# EAGLE design larrow (EAGLE 8.3.2)
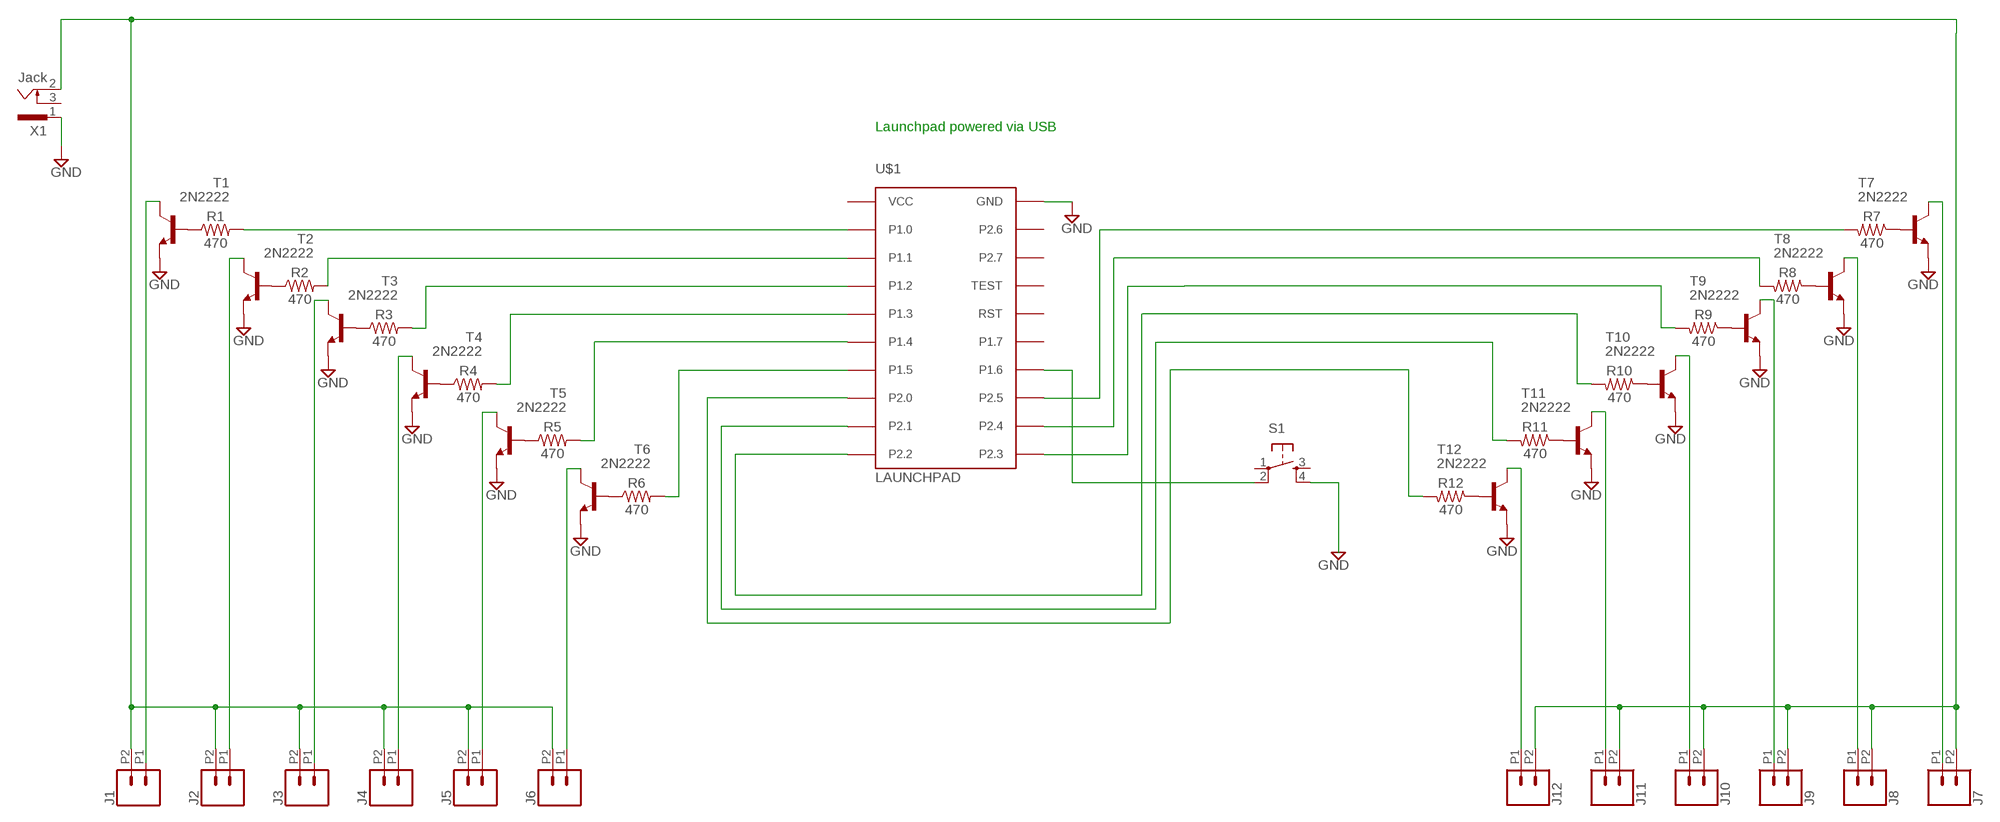
[diagram p0: schematic, sheet 1]

## Parts
J1  CONN_022.54MM_SCREWTERM  [1X02_2.54_SCREWTERM]
J2  CONN_022.54MM_SCREWTERM  [1X02_2.54_SCREWTERM]
J3  CONN_022.54MM_SCREWTERM  [1X02_2.54_SCREWTERM]
J4  CONN_022.54MM_SCREWTERM  [1X02_2.54_SCREWTERM]
J5  CONN_022.54MM_SCREWTERM  [1X02_2.54_SCREWTERM]
J6  CONN_022.54MM_SCREWTERM  [1X02_2.54_SCREWTERM]
J7  CONN_022.54MM_SCREWTERM  [1X02_2.54_SCREWTERM]
J8  CONN_022.54MM_SCREWTERM  [1X02_2.54_SCREWTERM]
J9  CONN_022.54MM_SCREWTERM  [1X02_2.54_SCREWTERM]
J10  CONN_022.54MM_SCREWTERM  [1X02_2.54_SCREWTERM]
J11  CONN_022.54MM_SCREWTERM  [1X02_2.54_SCREWTERM]
J12  CONN_022.54MM_SCREWTERM  [1X02_2.54_SCREWTERM]
R1  470  1KOHM-HORIZ-1/4W-1%  [AXIAL-0.3]
R2  470  1KOHM-HORIZ-1/4W-1%  [AXIAL-0.3]
R3  470  1KOHM-HORIZ-1/4W-1%  [AXIAL-0.3]
R4  470  1KOHM-HORIZ-1/4W-1%  [AXIAL-0.3]
R5  470  1KOHM-HORIZ-1/4W-1%  [AXIAL-0.3]
R6  470  1KOHM-HORIZ-1/4W-1%  [AXIAL-0.3]
R7  470  1KOHM-HORIZ-1/4W-1%  [AXIAL-0.3]
R8  470  1KOHM-HORIZ-1/4W-1%  [AXIAL-0.3]
R9  470  1KOHM-HORIZ-1/4W-1%  [AXIAL-0.3]
R10  470  1KOHM-HORIZ-1/4W-1%  [AXIAL-0.3]
R11  470  1KOHM-HORIZ-1/4W-1%  [AXIAL-0.3]
R12  470  1KOHM-HORIZ-1/4W-1%  [AXIAL-0.3]
S1  TAC_SWITCHPTH  [TACTILE-PTH]
T1  2N2222  [TO92-EBC-OVAL]
T2  2N2222  [TO92-EBC-OVAL]
T3  2N2222  [TO92-EBC-OVAL]
T4  2N2222  [TO92-EBC-OVAL]
T5  2N2222  [TO92-EBC-OVAL]
T6  2N2222  [TO92-EBC-OVAL]
T7  2N2222  [TO92-EBC-OVAL]
T8  2N2222  [TO92-EBC-OVAL]
T9  2N2222  [TO92-EBC-OVAL]
T10  2N2222  [TO92-EBC-OVAL]
T11  2N2222  [TO92-EBC-OVAL]
T12  2N2222  [TO92-EBC-OVAL]
U$1  LAUNCHPAD  [LAUNCHPAD]
X1  Jack  SCD-014A  [SCD-014-A]

## Nets
GND: S1.4 T1.E T2.E T3.E T4.E T5.E T6.E T7.E T8.E T9.E T10.E T11.E T12.E U$1.GND X1.1
N$1: J2.P1 T2.C
N$2: J1.P1 T1.C
N$3: R2.P$1 T2.B
N$4: R1.P$1 T1.B
N$5: R1.P$2 U$1.P1.0
N$6: R3.P$1 T3.B
N$7: J3.P1 T3.C
N$8: R4.P$1 T4.B
N$9: J4.P1 T4.C
N$10: R2.P$2 U$1.P1.1
N$11: R3.P$2 U$1.P1.2
N$12: R4.P$2 U$1.P1.3
N$13: R5.P$1 T5.B
N$14: J5.P1 T5.C
N$15: R5.P$2 U$1.P1.4
N$16: R6.P$1 T6.B
N$17: J6.P1 T6.C
N$18: R6.P$2 U$1.P1.5
N$20: R7.P$1 T7.B
N$21: J1.P2 J2.P2 J3.P2 J4.P2 J5.P2 J6.P2 J7.P2 J8.P2 J9.P2 J10.P2 J11.P2 J12.P2 X1.2
N$23: J7.P1 T7.C
N$24: R8.P$1 T8.B
N$25: J8.P1 T8.C
N$26: R9.P$1 T9.B
N$27: J9.P1 T9.C
N$28: R10.P$1 T10.B
N$29: J10.P1 T10.C
N$30: R8.P$2 U$1.P2.4
N$31: R9.P$2 U$1.P2.3
N$32: R10.P$2 U$1.P2.2
N$33: R11.P$1 T11.B
N$34: J11.P1 T11.C
N$35: R11.P$2 U$1.P2.1
N$36: R12.P$1 T12.B
N$37: J12.P1 T12.C
N$38: R12.P$2 U$1.P2.0
N$41: R7.P$2 U$1.P2.5
N$42: S1.2 U$1.P1.6
Unconnected: S1.1 S1.3 U$1.P1.7 U$1.P2.6 U$1.P2.7 U$1.RST U$1.TEST X1.3

## Notes on the sheet
- Launchpad powered via USB

## Power pins joined to a net without a drawn wire
VCC: U$1.VCC

## Library data of the parts
J1-J12 = SparkFun-Connectors:CONN_02: Multi connection point. Often used as Generic Header-pin footprint for 0.1 inch spaced/style header connections On any of the 0.1 inch spaced packages, you can populate with these: Break Away Headers - Straight <https://www.sparkfun.com/products/116> (PRT-00116) Break Away Male Headers - Right Angle <https://www.sparkfun.com/products/553> (PRT-00553) Female Headers <https://www.sparkfun.com/products/115> (PRT-00115) Break Away Headers - Machine Pin <https://www.sparkfun.com/products/117> (PRT-00117) Break Away Female Headers - Swiss Machine Pin <https://www.sparkfun.com/products/743> (PRT-00743) For SCREWTERMINALS and SPRING TERMINALS visit here: Screw Terimnals on SparkFun.com <https://www.sparkfun.com/search/results?term=Screw+Terminals> (5mm/3.5mm/2.54mm spacing) This device is also useful as a general connection point to wire up your design to another part of your project. Our various solder wires solder well into these plated through hole pads. Hook-Up Wire - Assortment (Stranded, 22 AWG) <https://www.sparkfun.com/products/11375> (PRT-11375) Hook-Up Wire - Assortment (Solid Core, 22 AWG) <https://www.sparkfun.com/products/11367> (PRT-11367) View the entire wire category on our website here <https://www.sparkfun.com/categories/141> Special notes: Molex polarized connector foot print use with: PRT-08233 with associated crimp pins and housings. 2.54_SCREWTERM for use with PRT-10571. 3.5mm Screw Terminal footprints for PRT-08084 5mm Screw Terminal footprints for use with PRT-08432
R1-R12 = SparkFun-Resistors:1KOHM: 1kΩ resistor A resistor is a passive two-terminal electrical component that implements electrical resistance as a circuit element. Resistors act to reduce current flow, and, at the same time, act to lower voltage levels within circuits. - Wikipedia; PROD_ID: RES-12182; VALUE: 1k
S1 = SparkFun-Retired:TAC_SWITCH: Momentary Switch Button commonly used for reset or general input. Spark Fun Electronics SKU : COM-00097 SMT- SWCH-08247
T1-T12 = adafruit:2N2222: NPN TRANSISTOR Big oval pads
U$1 = TI_launchpad:LAUNCHPAD: MSP-EXP430G2 LaunchPad Booster Pack layouts. LAUNCHPAD: Full-size board LAUNCHPAD-50MM: 50x50mm board covering the button area LAUNCHPAD-50MM-LEFT: 50x50mm board leaving the button area open. Tall LaunchPad components marked on Reference for reference.
X1 = con-shiua-chyuan:SCD-014A: Power Jack 2.5mm; OC_FARNELL: unknown; OC_NEWARK: unknown

## Board
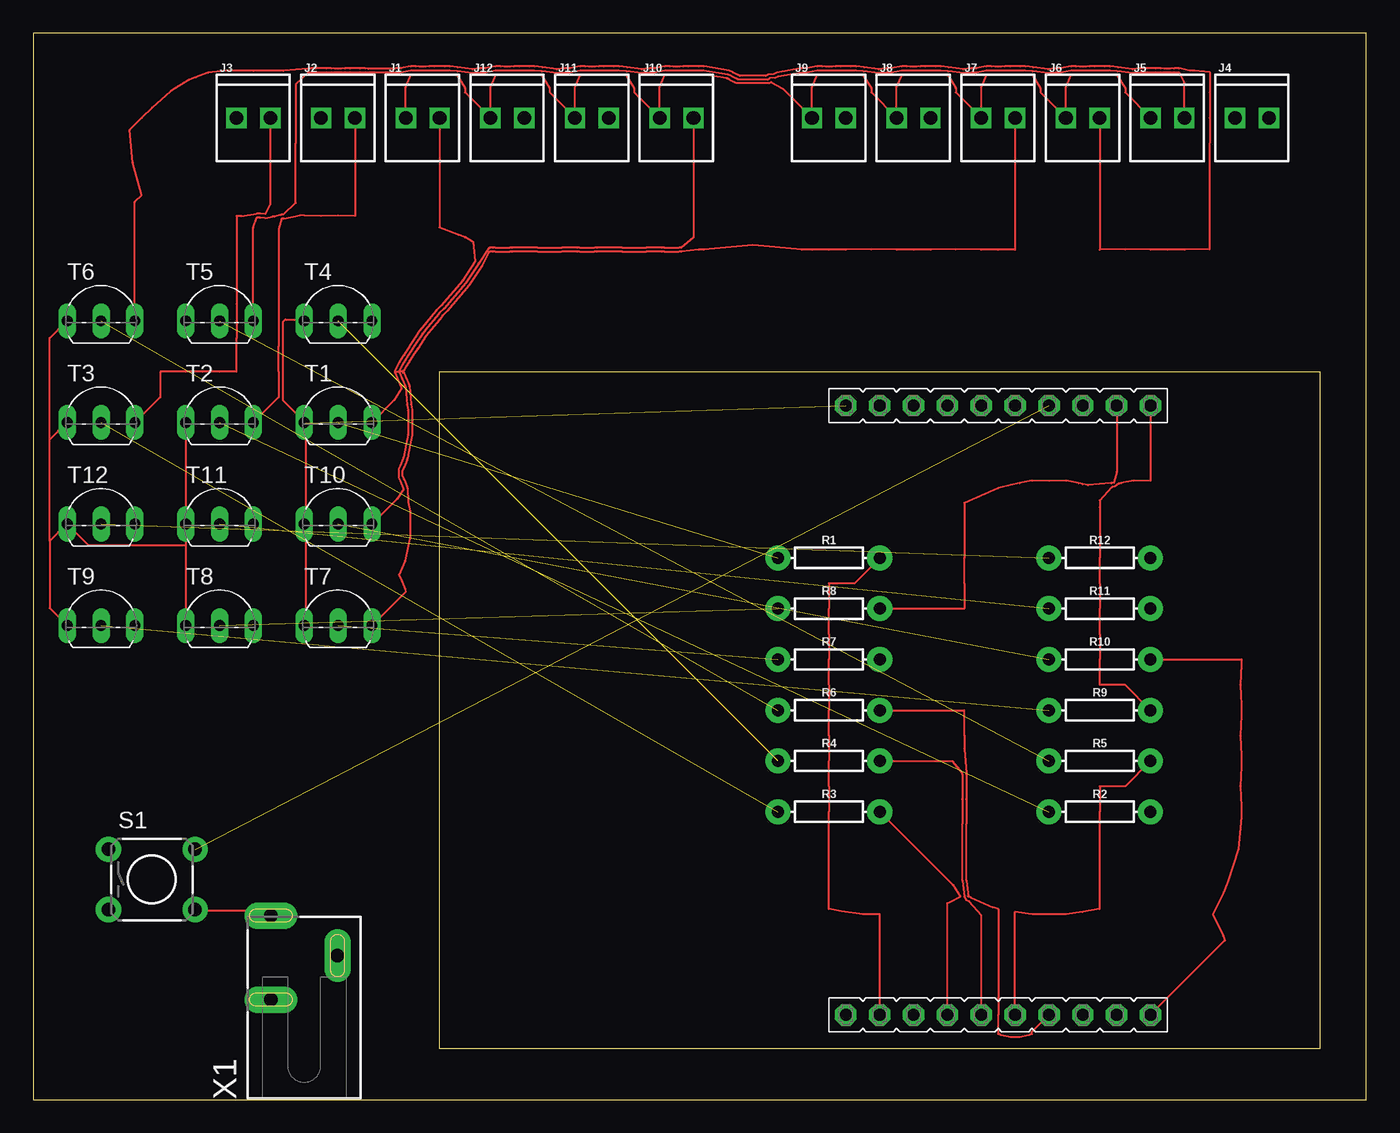
[diagram p1: board, top side]
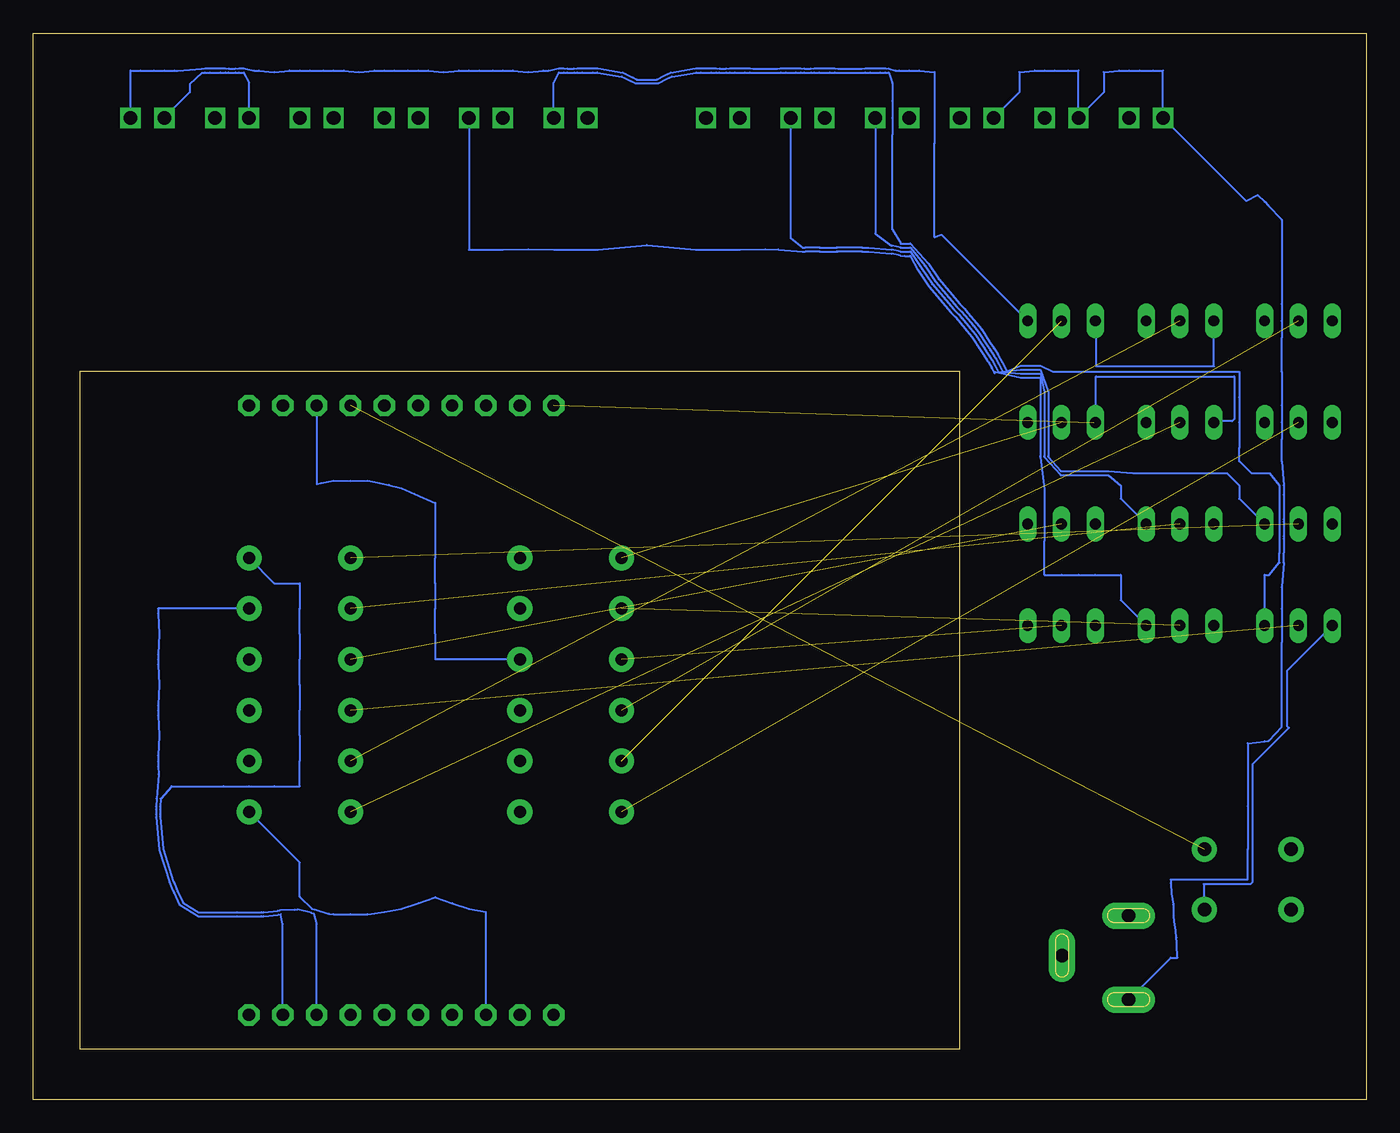
[diagram p2: board, bottom side, seen from below]

Size 100 x 80 mm. Coordinates in mm from the lower left corner, seen from the top.
Outline: 0,0 100,0 100,80 0,80 0,0
Copper layers (1*16): Top 0.035mm / dielectric 1.5mm / Bottom 0.035mm
Design rules "default": minimum track width 6mil, minimum drill 0.35mm, track to track 6mil, track to pad 6mil, pad to pad 6mil, via to via 6mil, smd to smd 6mil, copper to edge 40mil, drill to drill 6mil, minimum pad ring 10mil, minimum via ring 8mil, stop-mask expansion 4mil, vias tented up to drill 0mil, thermal gap 10mil

### Footprints (pad centres in the part's own frame; a part is rotated, then mirrored left to right if it is on the bottom)
1X02_2.54_SCREWTERM = drill 1.016 square: P1 2.54,0; P2 0,0
AXIAL-0.3 = drill 0.9 pad 1.88: P$1 -3.81,0; P$2 3.81,0
TACTILE-PTH = drill 1.016 pad 1.88: 1 -3.251,2.261; 2 3.251,2.261; 3 -3.251,-2.261; 4 3.251,-2.261
TO92-EBC-OVAL = drill 0.813 long: B 0,-1.27; C 2.54,-1.27; E -2.54,-1.27
LAUNCHPAD = drill 0.914 pad 1.6 octagon: GND 30.48,48.26; P1.0 33.02,2.54; P1.1 35.56,2.54; P1.2 38.1,2.54; P1.3 40.64,2.54; P1.4 43.18,2.54; P1.5 45.72,2.54; P1.6 45.72,48.26; P1.7 43.18,48.26; P2.0 48.26,2.54; P2.1 50.8,2.54; P2.2 53.34,2.54; P2.3 53.34,48.26; P2.4 50.8,48.26; P2.5 48.26,48.26; P2.6 33.02,48.26; P2.7 35.56,48.26; RST 40.64,48.26; TEST 38.1,48.26; VCC 30.48,2.54
SCD-014-A = drill 1 pad 2 long: 1 -2.5,13.8; 2 -2.5,7.5; 3 2.5,10.8

### Placement (x,y rotation side)
J1  27.94,73.66 0 top
J2  21.59,73.66 0 top
J3  15.24,73.66 0 top
J4  90.17,73.66 0 top
J5  83.82,73.66 0 top
J6  77.47,73.66 0 top
J7  71.12,73.66 0 top
J8  64.77,73.66 0 top
J9  58.42,73.66 0 top
J10  46.99,73.66 0 top
J11  40.64,73.66 0 top
J12  34.29,73.66 0 top
R1  59.69,40.64 0 top
R2  80.01,21.59 0 top
R3  59.69,21.59 0 top
R4  59.69,25.4 0 top
R5  80.01,25.4 0 top
R6  59.69,29.21 0 top
R7  59.69,33.02 0 top
R8  59.69,36.83 0 top
R9  80.01,29.21 0 top
R10  80.01,33.02 0 top
R11  80.01,36.83 0 top
R12  80.01,40.64 0 top
S1  8.89,16.51 0 top
T1  22.86,52.07 0 top
T2  13.97,52.07 0 top
T3  5.08,52.07 0 top
T4  22.86,59.69 0 top
T5  13.97,59.69 0 top
T6  5.08,59.69 0 top
T7  22.86,36.83 0 top
T8  13.97,36.83 0 top
T9  5.08,36.83 0 top
T10  22.86,44.45 0 top
T11  13.97,44.45 0 top
T12  5.08,44.45 0 top
U$1  30.48,3.81 0 top
X1  20.32,0 0 top

### Tracks (layer width: path | path; a pad name or v marks a point on that pad's centre or on a via)
GND  (1 unrouted)
  Top 0.152: T7.E 20.42,35.66 20.42,43.13 T10.E 20.42,43.28 20.42,50.75 T1.E 20.27,50.9 18.75,52.43 18.75,58.37 18.9,58.52 20.27,58.52 T4.E | 11.43,41.6 T11.E T2.E | 11.43,41.6 T8.E | S1.4 12.19,14.17 17.37,14.17 17.68,13.87 X1.1 | T9.E 1.22,36.88 1.22,41.91 | 1.22,41.91 2.44,43.13 T12.E 4.12,41.6 11.43,41.6 | 1.22,49.53 2.44,50.75 T3.E | 1.22,41.91 1.22,49.53 | 1.22,49.53 1.22,57.15 2.44,58.37 T6.E
  Bottom 0.152: T5.E 11.43,55.02 20.27,55.02 20.27,58.37 T4.E | T2.E 11.43,50.9 10.06,50.9 9.91,51.05 9.91,54.25 20.27,54.25 20.27,50.9 T1.E | T9.E 5.94,32.16 5.94,28.04 5.79,27.89 8.53,25.15 8.53,16.31 8.69,16.15 12.19,16.15 12.19,14.33 S1.4
N$1
  Top 0.152: J2.P1 24.13,66.28 22.86,66.33 21.59,66.28 20.32,66.33 20,66.35 18.79,66.11 18.61,66.09 18.41,65.3 18.41,60.33 18.41,58.42 18.41,56.52 18.41,54.61 18.41,52.7 T2.C
N$2
  Top 0.152: J1.P1 30.48,65.42 31.87,64.89 32.38,64.7 33.01,64.35 33.15,62.9 32.2,61.45 30.58,59.56 30.26,59.24 30.25,59.23 29.99,58.92 29.36,58.15 28.96,57.67 28.34,56.71 | T1.C 27.08,52.48 27.62,53.39 27.6,53.48 27.39,53.99 27.13,54.54 27.43,54.61 27.13,54.61 27.13,54.68 27.41,55.24 27.71,55.74 27.76,55.83 28.07,56.3 28.34,56.71 | 28.34,56.71
N$3  (1 unrouted)
N$4  (1 unrouted)
N$5
  Top 0.152: R1.P$2 61.59,38.73 59.69,38.73 59.69,36.83 59.69,34.92 59.69,33.02 59.69,31.11 59.69,29.21 59.69,27.3 59.69,25.4 59.69,23.5 59.69,21.59 59.69,17.78 59.69,14.3 60.63,14.13 62.23,13.9 63.5,13.9 U$1.P1.0
N$6  (1 unrouted)
N$7
  Top 0.152: J3.P1 17.78,67.18 17.41,66.44 17.02,66.47 16.77,66.48 15.6,66.3 15.24,66.28 15.24,59.69 15.24,58.42 15.24,57.15 15.24,54.61 13.97,54.61 12.7,54.61 11.43,54.61 9.53,54.61 9.53,52.7 T3.C
N$8  (1 unrouted)
N$9
  Bottom 0.152: J4.P1 92.71,77.21 91.95,77.21 91.44,77.19 90.93,77.21 90.17,77.21 89.41,77.21 89.17,77.19 87.37,77.34 87.13,77.36 86.74,77.36 85.98,77.36 85.59,77.36 85.34,77.35 84.84,77.35 84.58,77.36 84.2,77.36 83.44,77.21 83.06,77.21 81.92,77.09 80.77,77.21 80.01,77.21 79.25,77.21 78.74,77.19 78.23,77.21 77.47,77.21 76.71,77.21 75.56,77.09 74.42,77.21 73.66,77.21 72.9,77.21 72.39,77.19 71.88,77.21 71.12,77.21 70.36,77.21 69.22,77.09 68.07,77.21 67.31,77.21 66.55,77.21 66.04,77.19 65.53,77.21 64.77,77.21 64.01,77.21 62.87,77.09 61.72,77.21 61.34,77.21 60.58,77.36 60.2,77.36 59.94,77.35 59.44,77.35 59.19,77.36 58.8,77.36 58.04,77.36 57.65,77.36 55.77,77.05 55.53,76.94 55.02,76.68 54.73,76.54 53.22,76.54 52.93,76.68 52.42,76.94 52.18,77.05 50.3,77.36 49.91,77.36 49.15,77.36 48.77,77.36 48.51,77.35 48.01,77.35 47.76,77.36 47.37,77.36 46.61,77.36 46.22,77.36 45.98,77.34 44.19,77.34 43.95,77.36 43.56,77.36 42.8,77.36 42.41,77.36 42.16,77.35 41.66,77.35 41.41,77.36 41.02,77.36 40.26,77.36 39.87,77.36 39.63,77.34 37.84,77.34 37.6,77.36 37.21,77.36 36.45,77.36 36.06,77.36 35.81,77.35 35.31,77.2 35.05,77.21 34.29,77.21 33.53,77.21 32.38,77.09 32.38,75.56 32.38,73.66 32.38,71.75 32.38,64.7 31.87,64.89 T4.C
N$10
  Bottom 0.152: R2.P$2 80.01,17.78 80.01,15.21 79.08,14.29 78.9,14.26 77.83,13.95 77.47,13.9 76.2,13.9 74.93,13.9 73.66,14.08 72.39,14.3 71.12,14.72 69.85,15.18 68.58,14.72 67.31,14.3 66.04,14.08 U$1.P1.1
N$11
  Top 0.152: R3.P$2 68.99,16.1 69.55,15.22 69.55,15.21 68.7,14.76 68.58,14.72 U$1.P1.2
N$12
  Top 0.152: R4.P$2 68.94,25.4 69.7,24.49 69.7,24.41 69.7,22.58 69.7,22.5 69.7,20.68 69.7,16.46 69.85,15.22 69.85,15.21 70,14.96 70.21,14.89 71.12,13.8 U$1.P1.3
N$13  (1 unrouted)
N$14
  Top 0.152: J5.P1 86.36,76.3 85.98,77.06 85.6,77.06 85.35,77.05 84.83,77.05 84.58,77.06 84.2,77.06 83.44,77.06 83.07,77.06 82.5,77 81.34,77.15 80.77,77.21 80.39,77.21 79.63,77.21 79.25,77.21 78.99,77.2 78.49,77.2 78.23,77.21 77.85,77.21 77.09,77.06 76.72,77.06 76.15,77 74.99,77.15 74.42,77.21 74.04,77.21 73.28,77.21 72.9,77.21 72.64,77.2 72.14,77.2 71.88,77.21 71.5,77.21 70.74,77.06 70.37,77.06 69.8,77 68.64,77.15 68.07,77.21 67.69,77.21 66.93,77.21 66.55,77.21 66.29,77.2 65.79,77.2 65.53,77.21 65.15,77.21 64.39,77.06 64.02,77.06 63.45,77 62.29,77.15 61.72,77.21 61.34,77.21 60.58,77.21 60.2,77.21 59.94,77.2 59.44,77.2 59.18,77.21 58.8,77.21 58.04,77.06 57.67,77.06 55.86,76.76 55.67,76.66 55.23,76.61 55.07,76.54 52.88,76.54 52.72,76.61 52.35,76.8 52.13,76.91 50.29,77.21 49.91,77.21 49.15,77.21 48.77,77.21 48.51,77.2 48.01,77.2 47.75,77.21 47.37,77.21 46.61,77.06 46.24,77.06 45.67,77 44.51,77.15 43.94,77.21 43.56,77.21 42.8,77.21 42.42,77.21 42.16,77.2 41.66,77.2 41.4,77.21 41.02,77.21 40.26,77.06 39.89,77.06 39.32,77 38.16,77.15 37.59,77.21 37.21,77.21 36.45,77.21 36.07,77.21 35.81,77.2 35.31,77.2 35.05,77.21 34.67,77.21 33.91,77.06 33.54,77.06 32.97,77 31.81,77.15 31.24,77.21 30.86,77.21 30.1,77.21 29.72,77.21 29.46,77.2 28.96,77.2 28.7,77.21 28.32,77.21 27.56,77.06 27.19,77.06 26.96,77.03 25.11,77.03 24.88,77.06 24.51,77.06 23.75,77.06 23.37,77.06 23.12,77.05 22.6,77.05 22.35,77.06 21.97,77.06 21.21,77.06 20.84,77.06 20.61,77.03 19.68,76.18 19.68,75.56 19.68,73.66 19.68,71.75 19.68,67.28 18.76,66.41 18.58,66.39 18.1,66.24 17.94,66.25 17.39,66.14 17.01,66.17 16.76,66.17 16.51,65.42 T5.C
N$15
  Top 0.152: R5.P$2 81.92,23.5 80.01,23.5 80.01,21.59 80.01,17.78 80.01,14.3 78.74,14.08 77.47,13.9 76.2,13.9 74.93,13.9 73.66,14.08 U$1.P1.4
N$16  (1 unrouted)
N$17
  Top 0.152: J6.P1 80.01,63.75 81.92,63.79 83.82,63.75 85.09,63.76 86.36,63.75 88.27,63.79 88.27,71.75 88.27,73.66 88.27,75.56 88.27,77.09 87.12,77.21 86.74,77.21 85.98,77.36 85.59,77.36 85.34,77.35 84.84,77.35 84.58,77.36 84.2,77.36 83.44,77.36 83.05,77.36 82.47,77.3 81.38,77.46 80.79,77.52 80.39,77.52 79.63,77.52 79.24,77.52 78.98,77.5 78.5,77.5 78.24,77.52 77.85,77.52 77.09,77.36 76.7,77.36 76.12,77.3 75.03,77.46 74.44,77.52 74.04,77.52 73.28,77.52 72.89,77.52 72.63,77.5 72.15,77.5 71.89,77.52 71.5,77.52 70.74,77.36 70.35,77.36 69.77,77.3 68.67,77.46 68.09,77.52 67.69,77.52 66.93,77.52 66.54,77.52 66.28,77.5 65.8,77.5 65.54,77.52 65.15,77.52 64.39,77.36 64,77.36 63.42,77.3 62.33,77.46 61.74,77.52 61.34,77.52 60.58,77.52 60.19,77.52 59.93,77.5 59.45,77.5 59.19,77.52 58.8,77.52 58.04,77.36 57.65,77.36 55.77,77.05 55.53,76.94 55.09,76.89 54.93,76.81 53.02,76.81 52.86,76.89 52.48,77.07 52.23,77.2 50.32,77.52 49.91,77.52 49.15,77.52 48.76,77.52 48.5,77.5 48.02,77.5 47.76,77.52 47.37,77.52 46.61,77.36 46.22,77.36 45.64,77.3 44.55,77.46 43.96,77.52 43.56,77.52 42.8,77.52 42.41,77.52 42.15,77.5 41.67,77.5 41.41,77.52 41.02,77.52 40.26,77.36 39.87,77.36 39.29,77.3 38.2,77.46 37.61,77.52 37.21,77.52 36.45,77.52 36.06,77.52 35.8,77.5 35.32,77.5 35.06,77.52 34.67,77.52 33.91,77.36 33.52,77.36 32.94,77.3 31.84,77.46 31.26,77.52 30.86,77.52 30.1,77.52 29.71,77.52 29.45,77.5 28.97,77.5 28.71,77.52 28.32,77.52 27.56,77.36 27.17,77.36 26.93,77.34 25.14,77.34 24.9,77.36 24.51,77.36 23.75,77.36 23.36,77.36 23.11,77.35 22.61,77.35 22.36,77.36 21.97,77.36 21.21,77.36 20.82,77.36 20.58,77.34 18.77,77.19 18.54,77.21 17.78,77.21 17.02,77.21 16.51,77.19 16,77.21 15.24,77.21 14.48,77.21 13.08,77.04 12.2,76.7 11.69,76.51 10.29,75.64 8.9,74.42 8.14,73.66 7.24,72.76 7.47,70.31 8.12,67.86 7.62,67.36 T6.C
N$18
  Top 0.152: R6.P$2 69.85,29.21 69.85,27.3 69.85,26.31 70,24.49 70,24.41 70,22.58 70,22.5 70,20.68 70,16.46 70.16,15.22 70.16,15.21 70.11,15.25 70.31,15.17 71.99,14.43 72.39,14.3 72.39,7.62 72.39,6.35 72.39,5.08 72.39,4.92 72.61,4.83 73.33,4.68 73.66,4.68 73.99,4.68 74.71,4.83 74.93,4.92 74.93,5.08 U$1.P1.5
N$20  (1 unrouted)
N$21
  Top 0.152: J5.P2 81.92,75.56 81.92,75.88 81.31,76.85 80.76,76.91 80.39,76.91 79.63,76.91 79.25,76.91 79.01,76.89 78.47,76.89 78.22,76.91 77.85,76.91 77.47,75.99 J6.P2 75.56,75.56 75.56,75.88 74.96,76.85 74.41,76.91 74.04,76.91 73.28,76.91 72.91,76.91 72.66,76.89 72.12,76.89 71.88,76.91 71.5,76.91 71.12,75.99 J7.P2 69.22,75.56 69.22,75.88 68.61,76.85 68.06,76.91 67.69,76.91 66.93,76.91 66.56,76.91 66.31,76.89 65.77,76.89 65.53,76.91 65.15,76.91 64.77,75.99 J8.P2 62.87,75.56 62.87,75.88 62.26,76.85 61.71,76.91 61.34,76.91 60.58,76.91 60.2,76.91 59.96,76.89 59.42,76.89 59.17,76.91 58.8,76.91 58.42,75.99 J9.P2 56.25,75.83 55.36,76.34 55.2,76.26 52.75,76.26 52.59,76.34 52.21,76.53 52.04,76.61 50.27,76.91 49.91,76.91 49.15,76.91 48.77,76.91 48.53,76.89 47.99,76.89 47.74,76.91 47.37,76.91 46.99,75.99 J10.P2 45.09,75.56 45.09,75.88 44.48,76.85 43.93,76.91 43.56,76.91 42.8,76.91 42.42,76.91 42.18,76.89 41.64,76.89 41.4,76.91 41.02,76.91 40.64,75.99 J11.P2 38.73,75.56 38.73,75.88 38.13,76.85 37.58,76.91 37.21,76.91 36.45,76.91 36.08,76.91 35.83,76.89 35.29,76.89 35.05,76.91 34.67,76.91 34.29,75.99 J12.P2 32.38,75.56 32.38,75.88 31.78,76.85 31.23,76.91 30.86,76.91 30.1,76.91 29.73,76.91 29.48,76.89 28.94,76.89 28.7,76.91 28.32,76.91 27.94,75.99 J1.P2
  Bottom 0.152: J4.P2 88.27,75.56 88.27,76.18 87.34,77.03 87.11,77.06 86.74,77.06 85.98,77.06 85.6,77.06 85.35,77.05 84.83,77.05 84.58,77.06 84.2,77.06 83.82,76.3 J5.P2 | J1.P2 26.04,75.56 26.04,77.09 24.89,77.21 24.13,77.21 23.37,77.21 22.86,77.19 22.35,77.21 21.59,77.21 J2.P2 19.68,75.56 19.68,77.09 18.54,77.21 17.78,77.21 17.02,77.21 16.51,77.19 16,77.21 15.24,77.21 J3.P2 9,67.42 8.12,67.86 7.62,67.36 7.35,67.09 6.35,66.01 6.35,59.69 6.35,58.42 6.35,57.15 6.35,54.61 6.35,52.07 6.35,50.8 6.35,49.53 6.35,47.9 6.2,46.08 6.2,45.36 6.2,43.54 6.2,43.36 6.2,42.27 6.2,42.09 6.2,41 6.2,40.28 6.35,38.46 6.35,36.83 6.35,35.56 6.35,34.29 6.35,27.97 7.32,26.92 7.62,26.89 8.89,26.73 8.89,22.02 8.89,18.77 8.89,16.51 9.88,16.51 12.14,16.51 14.4,16.51 14.66,16.51 14.66,16.22 14.61,15.43 14.48,14.64 14.45,14.25 14.45,14.21 14.45,13.86 14.45,13.8 14.41,13.39 14.28,12.66 14.24,12.15 14.21,11.78 14.21,11.63 14.15,10.65 14.67,10.65 X1.2
N$23
  Top 0.152: J7.P1 73.66,63.75 72.39,63.76 71.12,63.75 69.22,63.79 67.31,63.75 66.04,63.76 64.77,63.75 62.87,63.79 60.96,63.75 59.69,63.76 58.42,63.75 57.66,63.75 53.98,64.12 50.29,63.75 49.91,63.75 48.62,63.61 48.44,63.61 47.35,63.6 47.17,63.6 46.07,63.62 46,63.62 44.17,63.62 44.1,63.62 42.27,63.61 42.09,63.61 41,63.6 40.82,63.6 39.72,63.62 39.65,63.62 37.82,63.62 37.75,63.62 35.91,63.61 35.74,63.61 34.65,63.6 34.47,63.6 34.24,63.6 34.18,63.6 33.66,62.57 32.68,61.09 31.03,59.15 30.7,58.81 30.71,58.82 30.46,58.53 29.83,57.76 29.45,57.3 28.81,56.32 | T7.C 27.94,38.1 27.89,38.33 27.66,38.87 27.43,39.37 27.66,39.87 27.89,40.41 27.94,40.64 28.27,42.25 28.27,43.18 28.27,44.11 28.12,44.82 28.06,45.86 28.04,45.99 27.8,46.55 27.69,46.8 27.69,47.17 27.8,47.43 28.04,47.99 28.06,48.12 28.27,49.13 28.42,49.85 28.42,49.89 28.42,51.71 28.42,51.75 28.33,52.17 28.21,53.51 28.18,53.66 27.94,54.23 27.74,54.68 27.43,54.61 27.74,54.61 27.74,54.54 27.95,54.95 28.23,55.42 28.27,55.5 28.58,55.97 28.81,56.32 | 28.81,56.32
N$24  (1 unrouted)
N$25
  Bottom 0.152: J8.P1 67.31,63.75 66.04,63.76 64.77,63.75 62.87,63.79 60.96,63.75 59.69,63.76 58.42,63.75 57.66,63.75 53.98,64.12 50.29,63.75 49.53,63.75 48.26,63.76 46.99,63.75 45.09,63.79 44.09,63.77 42.27,63.61 42.09,63.61 41,63.6 40.82,63.6 39.72,63.62 39.65,63.62 37.82,63.62 37.33,63.61 35.61,63.46 35.58,63.46 34.93,63.3 34.61,63.3 34.24,63.3 34.18,63.3 33.62,62.23 32.81,61 31.14,59.04 30.8,58.71 30.82,58.72 30.58,58.43 29.94,57.66 29.57,57.22 28.93,56.23 | T8.C 18.41,37.47 18.41,39.37 20.32,39.37 21.59,39.37 22.86,39.37 24.13,39.37 24.13,41.91 24.13,43.18 24.13,44.45 24.13,45.77 24.43,48.21 24.43,48.31 24.43,49.55 24.43,49.58 24.43,50.83 24.43,50.85 24.43,52.58 24.43,53.09 24.45,54.15 24.77,54.15 25.65,54.15 25.91,54.15 27.89,54.61 27.89,54.5 28.08,54.87 28.36,55.34 28.4,55.41 28.71,55.88 28.93,56.23 | 28.93,56.23
N$26  (1 unrouted)
N$27
  Bottom 0.152: J9.P1 60.96,76.3 60.58,77.06 60.2,77.06 59.95,77.05 59.43,77.05 59.18,77.06 58.8,77.06 58.04,77.06 57.67,77.06 55.86,76.76 55.67,76.66 55.16,76.41 54.86,76.26 53.09,76.26 52.79,76.41 52.28,76.66 52.09,76.76 50.28,77.06 49.91,77.06 49.15,77.06 48.77,77.06 48.52,77.05 48,77.05 47.75,77.06 47.37,77.06 46.61,77.06 46.24,77.06 46.01,77.03 44.16,77.03 43.93,77.06 43.56,77.06 42.8,77.06 42.42,77.06 42.17,77.05 41.65,77.05 41.4,77.06 41.02,77.06 40.26,77.06 39.89,77.06 39.66,77.03 37.81,77.03 37.58,77.06 37.21,77.06 36.45,77.06 36.07,77.06 35.82,77.05 35.56,76.27 35.56,74.93 35.56,73.66 35.56,72.39 35.56,65.28 34.92,64.22 34.6,64.21 34.24,64.21 34.18,64.21 32.86,62.73 32.07,61.55 30.47,59.66 30.16,59.35 30.14,59.34 29.88,59.02 29.24,58.24 28.84,57.76 28.22,56.8 | T9.C 7.62,39.37 7.26,39.37 6.5,40.28 6.5,41 6.5,42.09 6.5,42.27 6.5,43.36 6.5,43.54 6.5,45.36 6.5,46.08 7.26,46.99 7.62,46.99 8.61,46.99 9.53,47.9 9.53,48.9 9.53,50.8 9.53,52.7 9.53,54.61 11.43,54.61 12.7,54.61 13.97,54.61 15.24,54.61 16.51,54.61 18.41,54.61 20.32,54.61 21.59,54.61 22.86,54.61 23.5,54.61 24.45,55.07 24.77,55.07 25.65,55.07 25.91,55.07 26.98,54.61 26.98,54.72 27.28,55.31 27.58,55.82 27.64,55.91 27.94,56.38 28.22,56.8 | 28.22,56.8
N$28  (1 unrouted)
N$29
  Top 0.152: 27.43,54.61 | J10.P1 49.53,64.67 48.62,63.91 48.44,63.91 47.34,63.91 47.17,63.91 46.08,63.92 46,63.92 44.17,63.92 44.09,63.92 42.27,63.91 42.09,63.91 40.99,63.91 40.82,63.91 39.73,63.92 39.65,63.92 37.82,63.92 37.74,63.92 35.92,63.91 35.74,63.91 34.65,63.91 34.47,63.91 34.24,63.91 34.18,63.91 33.41,62.74 32.44,61.27 30.8,59.35 30.48,59.03 | T10.C 27.29,45.07 27.77,45.8 27.75,45.9 27.52,46.43 27.41,46.68 27.41,47.3 27.52,47.55 27.75,48.08 27.77,48.18 27.97,49.19 28.12,49.88 28.12,49.89 28.12,51.71 28.12,51.72 28.04,52.11 27.91,53.45 27.89,53.56 27.66,54.11 27.43,54.61 | 30.48,59.03 30.23,58.73 29.59,57.95 29.21,57.49 28.57,56.52 | 30.48,59.03 | 28.57,56.52 28.32,56.13 28.02,55.66 27.97,55.58 27.68,55.09 27.43,54.61 | 28.57,56.52 | 27.43,54.61
N$30
  Top 0.152: U$1.P2.4 81.28,47.09 81.08,46.29 80.91,46.26 80.86,46.24 79.12,46.09 79.07,46.11 78.74,46.18 78.41,46.25 77.47,46.43 76.2,46.42 74.93,46.43 73.99,46.25 73.33,46.11 72.39,45.87 71.41,45.43 69.85,44.76 69.85,40.64 69.85,38.73 69.85,36.83 R8.P$2
N$31
  Top 0.152: U$1.P2.3 83.82,46.42 82.55,46.43 81.61,46.25 81.45,46.22 81.15,45.99 80.98,45.96 80.93,45.95 80.01,44.95 80.01,44.45 80.01,40.64 80.01,38.73 80.01,36.83 80.01,34.92 80.01,33.02 80.01,31.11 81.92,31.11 R9.P$2
N$32
  Top 0.152: R10.P$2 90.64,33.02 90.64,32.63 90.54,31.11 90.64,29.6 90.64,29.21 90.64,28.82 90.54,27.3 90.64,25.79 90.64,25.4 90.64,25.01 90.54,23.5 90.64,21.98 90.64,21.59 90.64,21.2 90.39,18.77 89.63,16.33 89.47,15.94 89.31,15.55 88.5,13.88 89.28,12.27 89.41,11.94 U$1.P2.2
N$33  (1 unrouted)
N$34
  Bottom 0.152: J11.P1 43.18,64.67 42.27,63.91 42.09,63.91 40.99,63.91 40.82,63.91 39.73,63.92 39.65,63.92 37.82,63.92 37.32,63.92 35.61,63.76 35.59,63.76 34.93,63.6 34.61,63.6 34.24,63.6 34.18,63.6 33.37,62.4 32.56,61.18 30.92,59.25 30.59,58.92 30.59,58.93 30.35,58.63 29.71,57.86 29.33,57.4 28.69,56.42 | T11.C 18.41,45.09 18.41,46.08 19.33,46.84 19.41,46.84 20.5,46.84 20.68,46.84 21.77,46.84 21.95,46.84 22.89,46.84 22.91,46.84 24.13,48.21 24.13,48.31 24.13,49.55 24.13,49.58 24.13,50.83 24.13,50.85 24.13,52.58 24.13,53.09 24.45,54.46 24.77,54.46 25.65,54.46 25.91,54.46 27.59,54.61 27.59,54.57 27.82,55.02 28.1,55.5 28.15,55.58 28.45,56.05 28.69,56.42 | 28.69,56.42
N$35
  Bottom 0.152: R11.P$2 90.64,36.83 90.64,36.44 90.54,34.92 90.64,33.41 90.64,33.02 90.64,32.63 90.54,31.11 90.64,29.6 90.64,29.21 90.64,28.82 90.54,27.3 90.64,25.79 90.64,25.4 90.64,25.01 90.6,24.41 90.75,22.59 90.79,21.98 90.79,21.79 90.79,21.39 90.79,21.19 90.54,18.73 89.78,16.28 89.69,16.08 89.53,15.69 89.45,15.49 89.04,14.64 87.59,13.73 84.73,13.74 82.91,13.74 82.73,13.74 81.62,13.87 81.44,13.9 81.28,13.16 U$1.P2.1
N$36  (1 unrouted)
N$37
  Bottom 0.152: J12.P1 36.83,64.97 35.61,64.07 35.59,64.07 34.92,63.91 34.61,63.91 34.24,63.91 34.18,63.91 33.11,62.56 32.32,61.36 30.69,59.46 30.37,59.14 30.37,59.13 30.11,58.82 29.47,58.05 29.08,57.58 28.45,56.61 | T12.C 9.53,45.09 9.53,46.08 10.44,46.99 11.43,46.99 12.7,46.99 13.97,46.99 15.24,46.99 16.51,46.99 17.5,46.99 19.33,47.14 19.41,47.14 20.5,47.14 20.68,47.14 21.77,47.14 21.95,47.14 22.89,47.14 22.91,47.14 23.82,48.21 23.82,48.31 23.82,49.55 23.82,49.58 23.82,50.83 23.82,50.85 23.82,52.58 23.82,53.09 24.45,54.76 24.77,54.76 25.65,54.76 25.91,54.76 27.28,54.61 27.28,54.65 27.55,55.16 27.84,55.66 27.89,55.75 28.2,56.21 28.45,56.61 | 28.45,56.61
N$38
  Bottom 0.152: R12.P$2 81.92,38.73 80.01,38.73 80.01,36.83 80.01,34.92 80.01,33.02 80.01,31.11 80.01,29.21 80.01,27.3 80.01,25.4 80.01,23.5 81.92,23.5 83.82,23.5 85.72,23.5 89.63,23.5 90.45,22.57 90.49,21.97 90.49,21.79 90.49,21.39 90.49,21.21 90.24,18.8 89.49,16.38 89.41,16.19 89.25,15.8 89.17,15.61 88.76,14.77 87.59,14.04 84.73,14.05 82.91,14.05 82.73,14.05 81.67,14.18 81.48,14.2 80.38,14.23 80.19,14.27 79.14,13.99 78.95,13.96 78.74,13.16 U$1.P2.0
N$41
  Bottom 0.152: U$1.P2.5 78.74,46.18 78.41,46.25 77.47,46.43 76.2,46.42 74.93,46.43 73.99,46.25 73.33,46.11 72.39,45.87 71.41,45.43 69.85,44.76 69.85,40.64 69.85,38.73 69.85,36.83 69.85,34.92 69.85,33.02 R7.P$2
N$42  (1 unrouted)